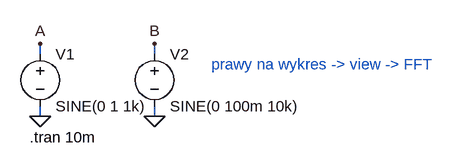
[diagram p0: schematic zad3_lista6.asc]
zad3_lista6.asc, the LTspice schematic file:
Version 4.1
SHEET 1 880 680
WIRE 64 112 64 96
WIRE 240 112 240 96
WIRE 64 208 64 192
WIRE 240 208 240 192
FLAG 240 208 0
FLAG 64 208 0
FLAG 64 96 A
FLAG 240 96 B
SYMBOL voltage 64 96 R0
WINDOW 123 0 0 Left 0
WINDOW 39 0 0 Left 0
SYMATTR InstName V1
SYMATTR Value SINE(0 1 1k)
SYMBOL voltage 240 96 R0
WINDOW 123 0 0 Left 0
WINDOW 39 0 0 Left 0
SYMATTR InstName V2
SYMATTR Value SINE(0 100m 10k)
TEXT 48 240 Left 2 !.tran 10m
TEXT 328 128 Left 2 ;prawy na wykres -> view -> FFT

The netlist it stands for:
* zad3_lista6.asc
V1 A 0 SINE(0 1 1k)
V2 B 0 SINE(0 100m 10k)
.tran 10m
* prawy na wykres -> view -> FFT
.backanno
.end